# EAGLE design CONVEYOR-v3_0 (EAGLE 9.7.0)

## Sheet 1 of 2
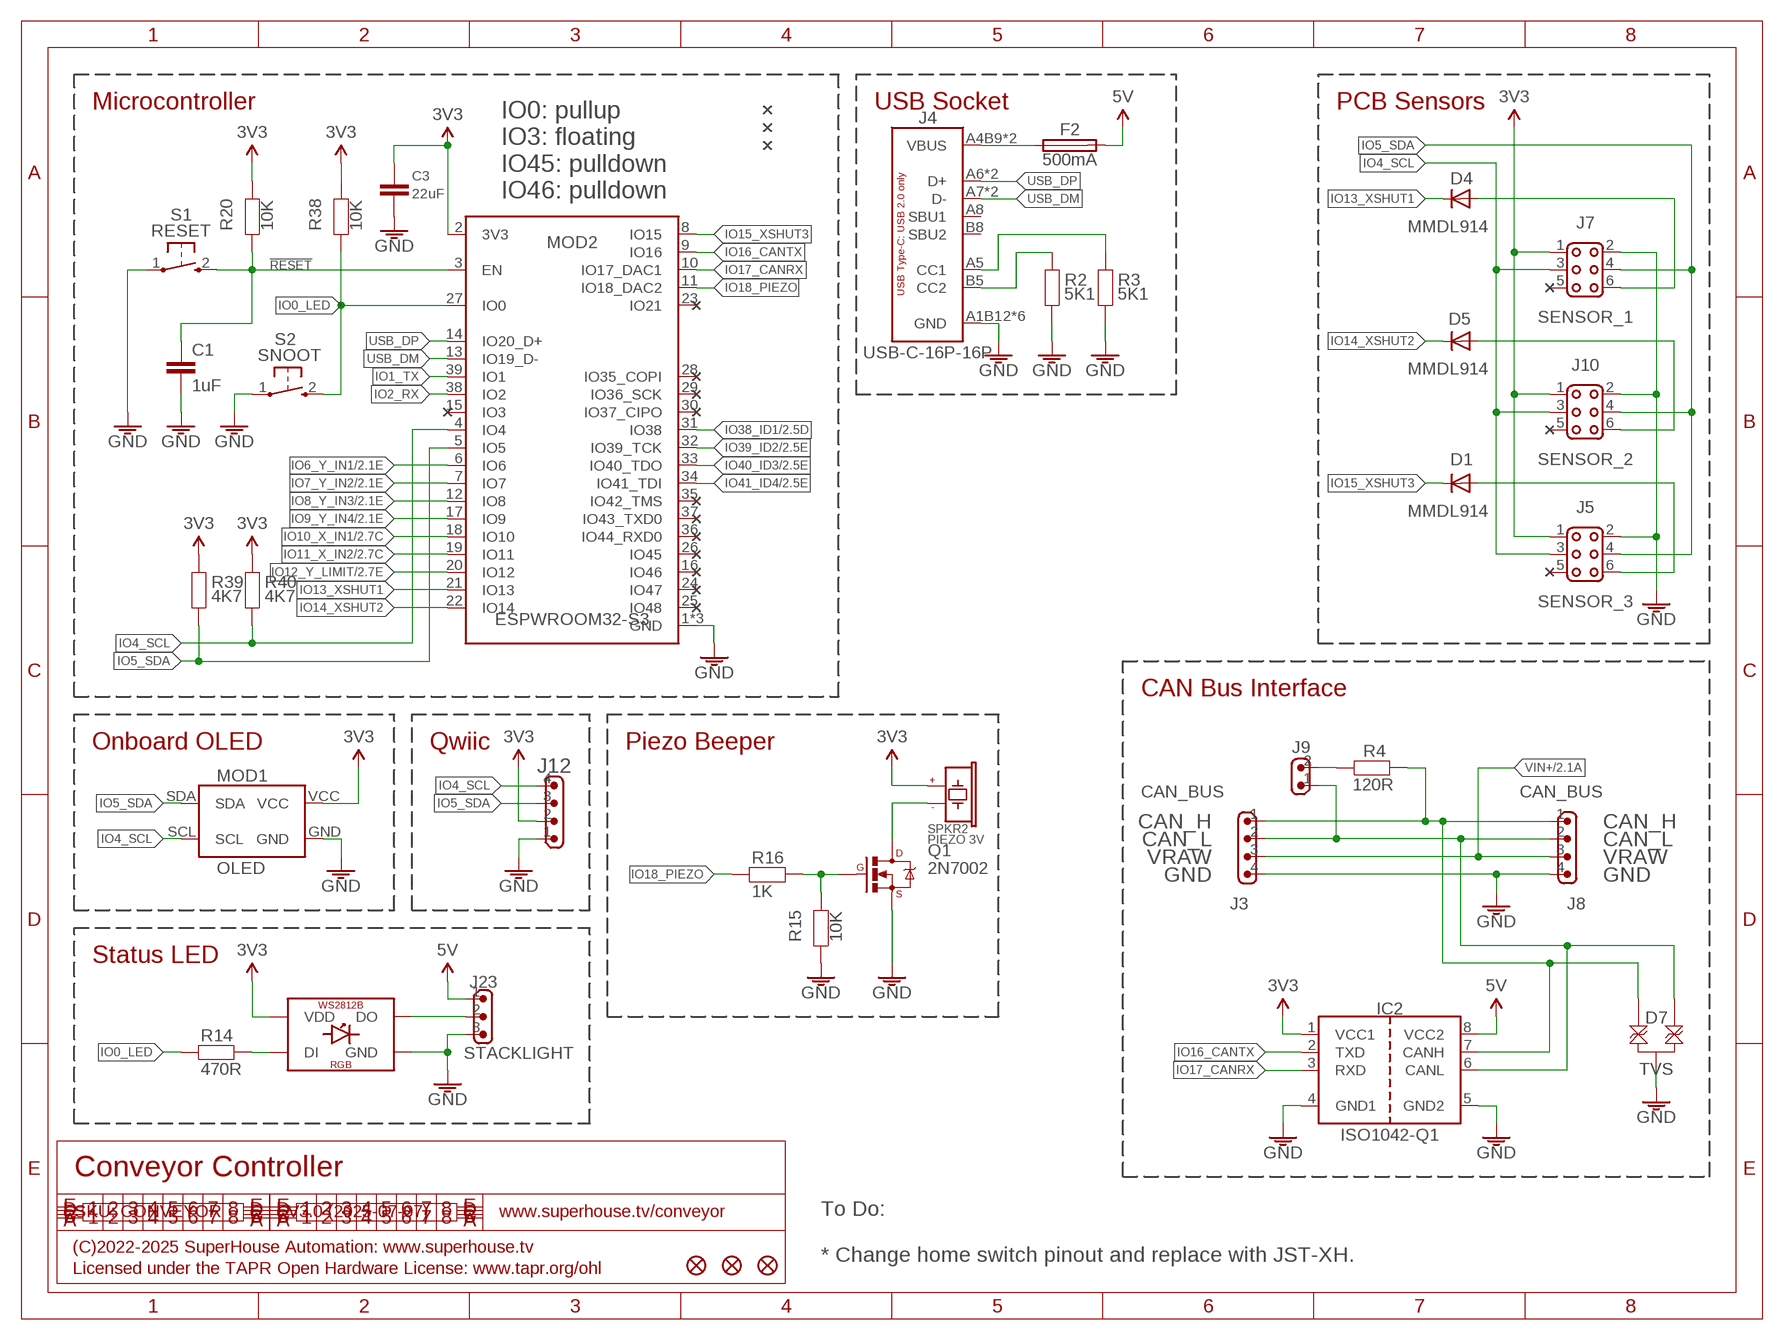
[diagram p0: schematic, sheet 1]

### Parts
C1  1uF  CAP0603  [C0603]
C3  22uF  CAP0805  [C0805]
D1  MMDL914  DIODE-SOD123  [SOD-123]
D4  MMDL914  DIODE-SOD123  [SOD-123]
D5  MMDL914  DIODE-SOD123  [SOD-123]
D7  TVS  TVSDUAL-T24CAN  [SOT23-3]
F2  500mA  PTC-1206  [1206]
IC2  ISO1042-Q1  [SO08-W]
J3  CAN_BUS  M04-SCREW-3.81MM-HOR-PLUG  [SCREWTERMINAL-3.81MM-PLUGGABLE-HOR-4]
J4  USB-C-16P-16P  [USB-C-16P]
J5  SENSOR_3  M02X3-SHROUDED  [2X3-2.54-SHROUDED]
J7  SENSOR_1  M02X3-SHROUDED  [2X3-2.54-SHROUDED]
J8  CAN_BUS  M04-SCREW-3.81MM-HOR-PLUG  [SCREWTERMINAL-3.81MM-PLUGGABLE-HOR-4]
J9  M02-PIN-JUMP-Y  [1X02-P-JUMP-Y]
J10  SENSOR_2  M02X3-SHROUDED  [2X3-2.54-SHROUDED]
J12  M04-SM4B-SH  [JST-SM4B-SH]
J23  STACKLIGHT  M03-PLAIN  [1X03]
LED2  WS2812B-PTH5MM  [5MM4PIN]
MOD1  OLED  OLED-I2C-128X32-0.91-HEADER  [OLED-128X32-0.91-HEADER]
MOD2  ESPWROOM32-S3  ESPWROOM32-S3-WROOM  [ESPWROOM32-S3]
Q1  2N7002  MOSFET-NCHANNEL-233  [SOT23-3]
R2  5K1  RESISTOR0603  [R0603]
R3  5K1  RESISTOR0603  [R0603]
R4  120R  RESISTOR2010  [R2010]
R14  470R  RESISTOR0603  [R0603]
R15  10K  RESISTOR0603  [R0603]
R16  1K  RESISTOR0603  [R0603]
R20  10K  RESISTOR0603  [R0603]
R38  10K  RESISTOR0603  [R0603]
R39  4K7  RESISTOR0603  [R0603]
R40  4K7  RESISTOR0603  [R0603]
S1  RESET  TAC_SWITCH_2PINSMT  [TACTILE_SMT_3X4X2]
S2  SNOOT  TAC_SWITCH_2PINSMT  [TACTILE_SMT_3X4X2]
SPKR2  PIEZO 3V  PIEZOPOLARISED-SMT  [PIEZO-9.6X9.6-SMT]
U$4  FIDUCIAL1X2.5  [FIDUCIAL-1X2.5]
U$5  FIDUCIAL1X2.5  [FIDUCIAL-1X2.5]
U$6  FIDUCIAL1X2.5  [FIDUCIAL-1X2.5]

### Nets
3.3V: C3.1 IC2.1(VCC1) J5.1 J7.1 J10.1 J12.2 LED2.2(VDD) MOD1.VCC MOD2.2(3V3) R20.1 R38.1 R39.1 R40.1 SPKR2.1(+) ; also sheet 2
5V: F2.2 IC2.8(VCC2) J23.1 ; also sheet 2
!RESET: C1.1 MOD2.3(EN) R20.2 S1.2(S)
CAN_H1: D7.2 IC2.7(CANH) J3.1 J8.1 R4.2
CAN_L1: D7.1 IC2.6(CANL) J3.2 J8.2 J9.1
GND: C1.2 C3.2 D7.3 IC2.4(GND1) IC2.5(GND2) J3.4 J4.A1B12(GND) J4.A12B1(GND) J4.FIX1(GND) J4.FIX2(GND) J4.FIX3(GND) J4.FIX4(GND) J5.2 J7.2 J8.4 J10.2 J12.1 J23.3 LED2.3(GND) MOD1.GND MOD2.1(GND) MOD2.40(GND) MOD2.41(GND) Q1.2(S) R2.2 R3.2 R15.2 S1.1(P) S2.1(P) ; also sheet 2
IO0_LED: MOD2.27(IO0) R14.1 R38.2 S2.2(S)
IO1_TX: MOD2.39(IO1)
IO2_RX: MOD2.38(IO2)
IO4_SCL: J5.3 J7.3 J10.3 J12.4 MOD1.SCL MOD2.4(IO4) R40.2
IO5_SDA: J5.4 J7.4 J10.4 J12.3 MOD1.SDA MOD2.5(IO5) R39.2
IO6_Y_IN1: MOD2.6(IO6) ; also sheet 2
IO7_Y_IN2: MOD2.7(IO7) ; also sheet 2
IO8_Y_IN3: MOD2.12(IO8) ; also sheet 2
IO9_Y_IN4: MOD2.17(IO9) ; also sheet 2
IO10_X_IN1: MOD2.18(IO10) ; also sheet 2
IO11_X_IN2: MOD2.19(IO11) ; also sheet 2
IO12_Y_LIMIT: MOD2.20(IO12) ; also sheet 2
IO13_XSHUT1: D4.1(C) MOD2.21(IO13)
IO14_XSHUT2: D5.1(C) MOD2.22(IO14)
IO15_XSHUT3: D1.1(C) MOD2.8(IO15)
IO16_CANTX: IC2.2(TXD) MOD2.9(IO16)
IO17_CANRX: IC2.3(RXD) MOD2.10(IO17_DAC1)
IO18_PIEZO: MOD2.11(IO18_DAC2) R16.1
IO38_ID1: MOD2.31(IO38) ; also sheet 2
IO39_ID2: MOD2.32(IO39_TCK) ; also sheet 2
IO40_ID3: MOD2.33(IO40_TDO) ; also sheet 2
IO41_ID4: MOD2.34(IO41_TDI) ; also sheet 2
N$1: J9.2 R4.1
N$2: LED2.4(DI) R14.2
N$3: D1.2(A) J5.6
N$6: J4.B5(CC2) R2.1
N$7: J4.A5(CC1) R3.1
N$11: F2.1 J4.A4B9(VBUS) J4.A9B4(VBUS)
N$21: J23.2 LED2.1(DO)
N$22: D5.2(A) J10.6
N$23: Q1.1(G) R15.1 R16.2
N$24: Q1.3(D) SPKR2.2(-)
N$27: D4.2(A) J7.6
USB_DM: J4.A7(D-) J4.B7(D-) MOD2.13(IO19_D-)
USB_DP: J4.A6(D+) J4.B6(D+) MOD2.14(IO20_D+)
VIN+: J3.3 J8.3 ; also sheet 2
Unconnected: J4.A8(SBU1) J4.B8(SBU2) J5.5 J7.5 J10.5 MOD2.15(IO3) MOD2.23(IO21) MOD2.24(IO47) MOD2.25(IO48) MOD2.26(IO45) MOD2.28(IO35_COPI) MOD2.29(IO36_SCK) MOD2.30(IO37_CIPO) MOD2.35(IO42_TMS) MOD2.36(IO44_RXD0) MOD2.37(IO43_TXD0)

### Notes on the sheet
- Microcontroller | USB Socket | PCB Sensors
- IO0: pullup
  IO3: floating
  IO45: pulldown
  IO46: pulldown
- CAN Bus Interface
- Onboard OLED | Qwiic | Piezo Beeper
- CAN_H | CAN_H
- CAN_L | CAN_L
- VRAW | VRAW
- GND | GND
- Status LED
- Conveyor Controller
- SKU: CONVEYOR | V3.0 (2025-07-07) | www.superhouse.tv/conveyor
- (C)2022-2025 SuperHouse Automation: www.superhouse.tv
- To Do:
  
  * Change home switch pinout and replace with JST-XH.
- Licensed under the TAPR Open Hardware License: www.tapr.org/ohl

## Sheet 2 of 2
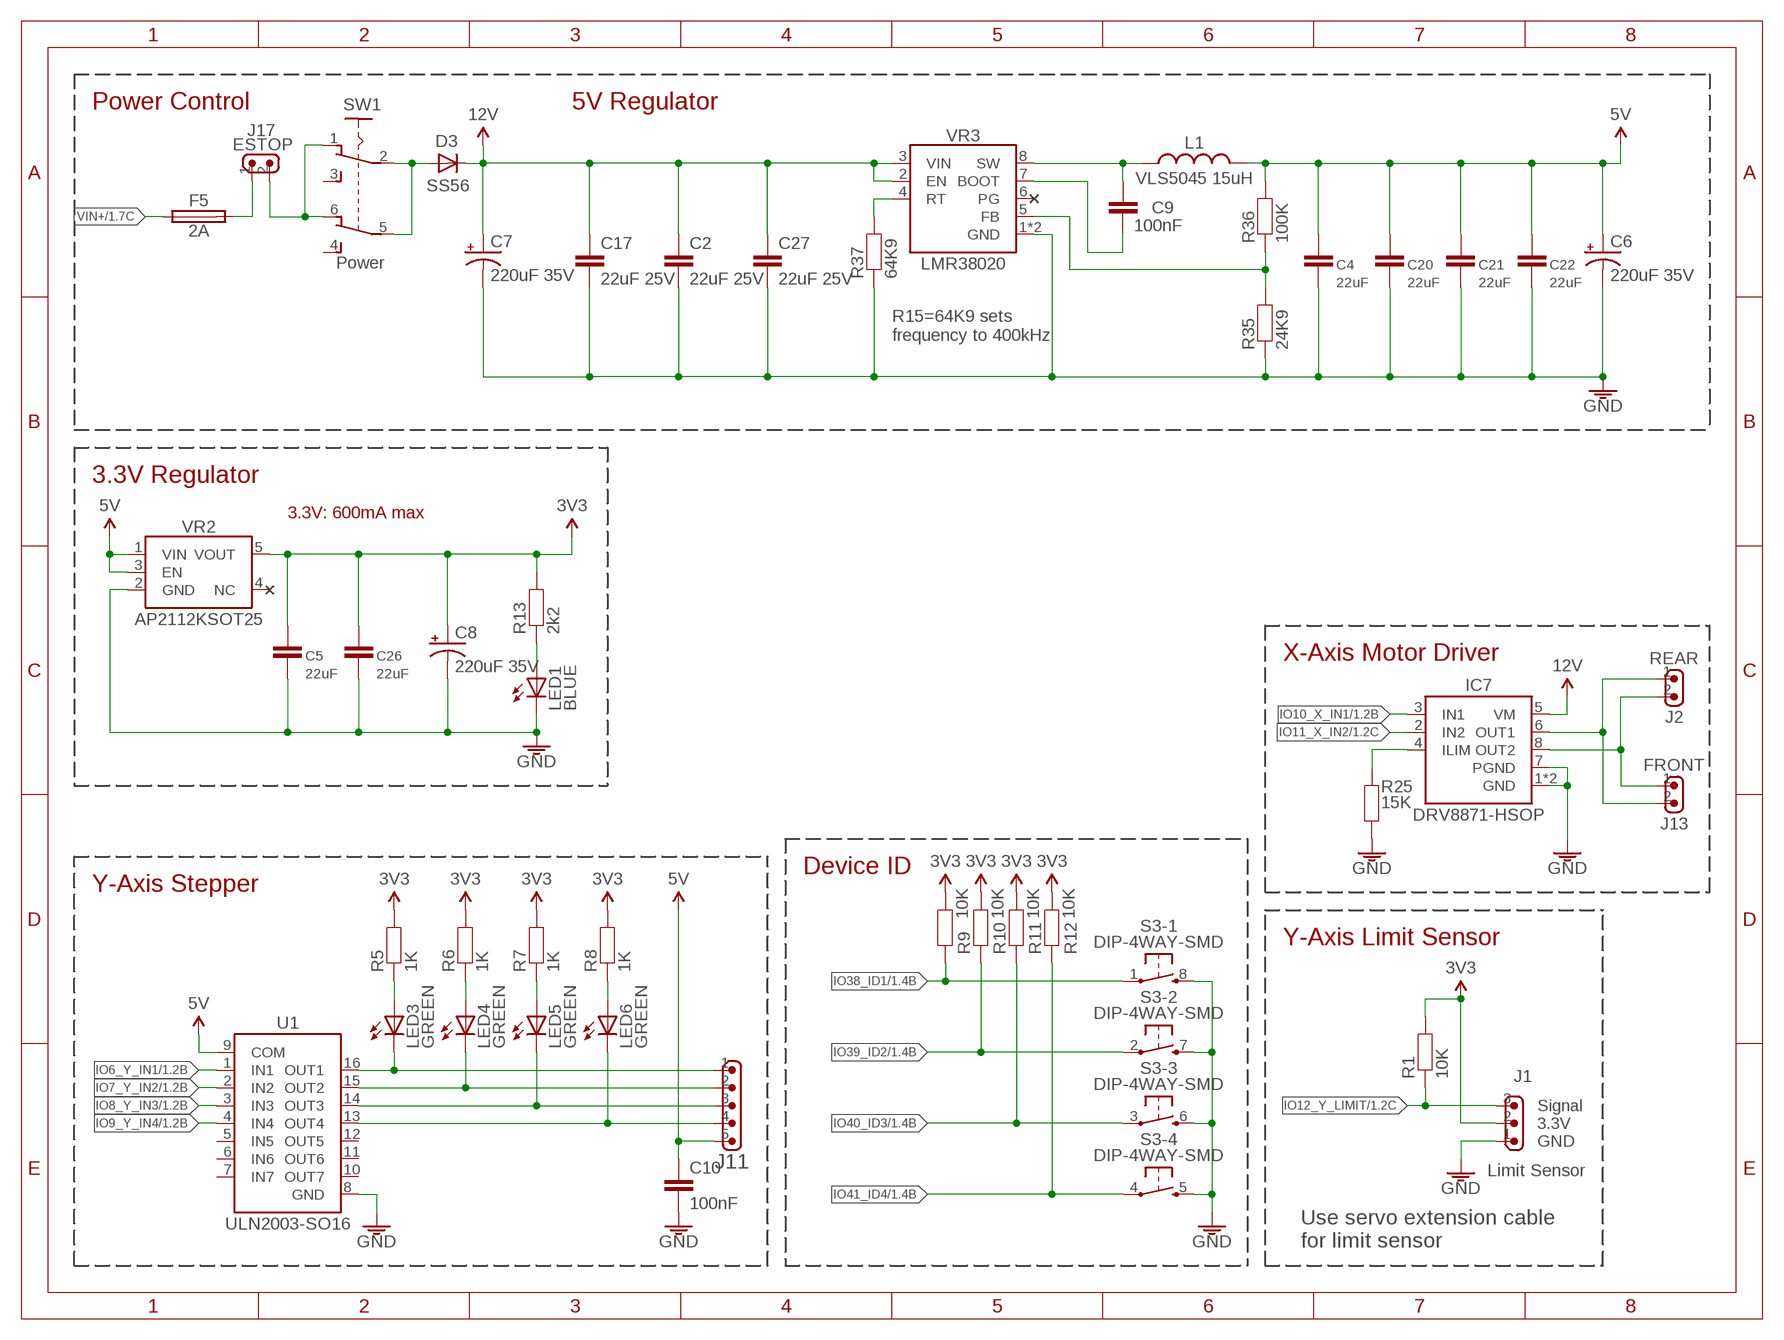
[diagram p1: schematic, sheet 2]

### Parts
C2  22uF 25V  CAP0805  [C0805]
C4  22uF  CAP0805  [C0805]
C5  22uF  CAP0805  [C0805]
C6  220uF 35V  CAP_POLG  [PANASONIC_G]
C7  220uF 35V  CAP_POLG  [PANASONIC_G]
C8  220uF 35V  CAP_POLG  [PANASONIC_G]
C9  100nF  CAP0603  [C0603]
C10  100nF  CAP0603  [C0603]
C17  22uF 25V  CAP0805  [C0805]
C20  22uF  CAP0805  [C0805]
C21  22uF  CAP0805  [C0805]
C22  22uF  CAP0805  [C0805]
C26  22uF  CAP0805  [C0805]
C27  22uF 25V  CAP0805  [C0805]
D3  SS56  DIODESMA  [SMA-DIODE]
F5  2A  FUSE-OMNIBLOK  [OMNIBLOK]
IC7  DRV8871-HSOP  [SOIC8T]
J1  Limit Sensor  M03-PIN  [1X03-P]
J2  REAR  M02-B2B-XH  [JST-B2B-XH-A]
J11  M05-B5B-XH  [JST-B5B-XH-A]
J13  FRONT  M02-B2B-XH  [JST-B2B-XH-A]
J17  ESTOP  M02-SCREW-3.81MM-HOR  [SCREWTERMINAL-3.81MM-PLUGGABLE-HOR-2]
L1  VLS5045 15uH  INDUCTOR-5045  [INDUCTOR-5045]
LED1  BLUE  LED0603  [LED-0603]
LED3  GREEN  LED0603  [LED-0603]
LED4  GREEN  LED0603  [LED-0603]
LED5  GREEN  LED0603  [LED-0603]
LED6  GREEN  LED0603  [LED-0603]
R1  10K  RESISTOR0603  [R0603]
R5  1K  RESISTOR0603  [R0603]
R6  1K  RESISTOR0603  [R0603]
R7  1K  RESISTOR0603  [R0603]
R8  1K  RESISTOR0603  [R0603]
R9  10K  RESISTOR0603  [R0603]
R10  10K  RESISTOR0603  [R0603]
R11  10K  RESISTOR0603  [R0603]
R12  10K  RESISTOR0603  [R0603]
R13  2k2  RESISTOR0603  [R0603]
R25  15K  RESISTOR0603  [R0603]
R35  24K9  RESISTOR0603  [R0603]
R36  100K  RESISTOR0603  [R0603]
R37  64K9  RESISTOR0603  [R0603]
S3  DIP-4WAY-SMD  [DIP-8-SMD]
SW1  Power  SWITCH-DPDT3  [7201SD9AV2BE]
U1  ULN2003-SO16  [SO16]
VR2  AP2112KSOT25  [SOT23-5]
VR3  LMR38020  LMR38010  [HSOIC8]

### Nets
3.3V: C5.1 C8.+ C26.1 J1.2 R1.2 R5.2 R6.2 R7.2 R8.2 R9.2 R10.2 R11.2 R12.2 R13.2 VR2.5(VOUT) ; also sheet 1
5V: C4.1 C6.+ C10.1 C20.1 C21.1 C22.1 J11.5 L1.2 R36.2 U1.9(COM) VR2.1(VIN) VR2.3(EN) ; also sheet 1
12V: C2.1 C7.+ C17.1 C27.1 D3.C IC7.5(VM) VR3.2(EN) VR3.3(VIN)
GND: C2.2 C4.2 C5.2 C6.- C7.- C8.- C10.2 C17.2 C20.2 C21.2 C22.2 C26.2 C27.2 IC7.1(GND) IC7.7(PGND) IC7.TGND(GND) J1.1 LED1.C R25.1 R35.1 R37.1 S3.5(-4:S) S3.6(-3:S) S3.7(-2:S) S3.8(-1:S) U1.8(GND) VR2.2(GND) VR3.1(GND) VR3.TGND(GND) ; also sheet 1
IO6_Y_IN1: U1.1(IN1) ; also sheet 1
IO7_Y_IN2: U1.2(IN2) ; also sheet 1
IO8_Y_IN3: U1.3(IN3) ; also sheet 1
IO9_Y_IN4: U1.4(IN4) ; also sheet 1
IO10_X_IN1: IC7.3(IN1) ; also sheet 1
IO11_X_IN2: IC7.2(IN2) ; also sheet 1
IO12_Y_LIMIT: J1.3 R1.1 ; also sheet 1
IO38_ID1: R9.1 S3.1(-1:P) ; also sheet 1
IO39_ID2: R10.1 S3.2(-2:P) ; also sheet 1
IO40_ID3: R11.1 S3.3(-3:P) ; also sheet 1
IO41_ID4: R12.1 S3.4(-4:P) ; also sheet 1
N$4: J17.2 SW1.1 SW1.6
N$5: IC7.4(ILIM) R25.2
N$8: F5.2 J17.1
N$9: D3.A SW1.2 SW1.5
N$12: LED3.A R5.1
N$13: J11.1 LED3.C U1.16(OUT1)
N$14: LED4.A R6.1
N$15: LED5.A R7.1
N$16: LED6.A R8.1
N$17: J11.2 LED4.C U1.15(OUT2)
N$18: J11.3 LED5.C U1.14(OUT3)
N$19: J11.4 LED6.C U1.13(OUT4)
N$25: IC7.6(OUT1) J2.1 J13.2
N$26: IC7.8(OUT2) J2.2 J13.1
N$29: LED1.A R13.1
N$30: C9.1 L1.1 VR3.8(SW)
N$33: R37.2 VR3.4(RT)
N$35: R35.2 R36.1 VR3.5(FB)
N$37: C9.2 VR3.7(BOOT)
VIN+: F5.1 ; also sheet 1
Unconnected: SW1.3 SW1.4 U1.5(IN5) U1.6(IN6) U1.7(IN7) U1.10(OUT7) U1.11(OUT6) U1.12(OUT5) VR2.4(NC)

### Notes on the sheet
- Power Control | 5V Regulator
- R15=64K9 sets
  frequency to 400kHz
- 3.3V Regulator
- 3.3V: 600mA max
- X-Axis Motor Driver
- Device ID
- Y-Axis Stepper
- Y-Axis Limit Sensor
- Signal
- 3.3V
- GND
- Use servo extension cable
  for limit sensor

## Power pins joined to a net without a drawn wire
IO46: MOD2.16(IO46)
PG: VR3.6(PG)

## Library data of the parts
C1-C5 C9 C10 C17 C20-C22 C26 C27 = SuperHouse-Capacitors:CAP: Capacitor Standard ceramic capacitor
C6-C8 = SuperHouse-Capacitors:CAP_POL: Capacitor Polarized These are standard SMD and PTH capacitors. Normally 10uF, 47uF, and 100uF in electrolytic and tantalum varieties. Always verify the external diameter of the through hole cap, it varies with capacity, voltage, and manufacturer. The EIA devices should be standard.
D1 D3-D5 = SuperHouse-Diodes:DIODE: Diode Standard reverse protection diodes and small signal diodes. SMA package can handle up to about 1A. SOD-323 can handle about 200mA.
D7 = SuperHouse-Diodes:TVSDUAL: Transient Voltage Suppressor (dual)
F2 = SuperHouse-Fuses:PTC: Resettable polyfuses
F5 = SuperHouse-Fuses:FUSE: Fuse
IC2 = SuperHouse-ICs:ISO1042-Q1
IC7 = SuperHouse-MotorDrivers:DRV8871: TI DRV8871 3.6A brushed DC motor driver
J1 J23 = SuperHouse-Connectors:M03: 3-way header Standard 1x3 header, and screw terminal variations
J2 J9 J13 J17 = SuperHouse-Connectors:M02: 2-way header Standard 1x2 header, and screw terminal variations
J3 J8 J12 = SuperHouse-Connectors:M04: 4-way header Standard 1x4 header, and screw terminal variations
J4 = SuperHouse-Connectors:USB-C-16P: USB-C socket with 16 pins, suitable only for backward compatibility with USB 2
J5 J7 J10 = SuperHouse-Connectors:M02X3: M6 header in 2x3 format
J11 = SuperHouse-Connectors:M05: 5-way header Standard 1x5 header, and screw terminal variations
L1 = SuperHouse-Inductors:INDUCTOR: INDUCTOR, American symbol
LED1 LED3-LED6 = SuperHouse-LEDs:LED: LEDs in various sizes including 5mm and 3mm PTH, and 0402, 0603, 0805, etc SMT
LED2 = SuperHouse-LEDs:WS2812B: WS2812B addressable RGB LED
MOD1 = SuperHouse-Displays:OLED-I2C: OLED module with SSD1306 I2C driver
MOD2 = SuperHouse-MCUs:ESPWROOM32-S3
Q1 = SuperHouse-Transistors:MOSFET-NCHANNEL: N-channel MOSFET
R1-R16 R20 R25 R35-R40 = SuperHouse-Resistors:RESISTOR: Resistors in both surface-mount and through-hole versions.
S1 S2 = SuperHouse-Switches:TAC_SWITCH_2PIN: Momentary Tactile Switch - 2 pin Uxcell 3x4x2mm switch with 2 SMT pads
S3 = SuperHouse-Switches:DIP-4WAY
SPKR2 = SuperHouse-Audio:PIEZOPOLARISED
SW1 = SuperHouse-Switches:SWITCH-DPDT: DPDT toggle switch
U1 = SuperHouse-ICs:ULN2003: 7-channel Darlington array, commonly used as a low-power stepper motor driver
U$4-U$6 = SuperHouse-Symbols:FIDUCIAL: Fiducial Alignment Points Various fiducial points for machine vision alignment.
VR2 = SuperHouse-Regulators:AP2112K: AP2112K LDO linear voltage regulator
VR3 = SuperHouse-Regulators:LMR38010

## Net classes
0 Default: width 0.203 mm
1 VCC: width 0.305 mm

## Board
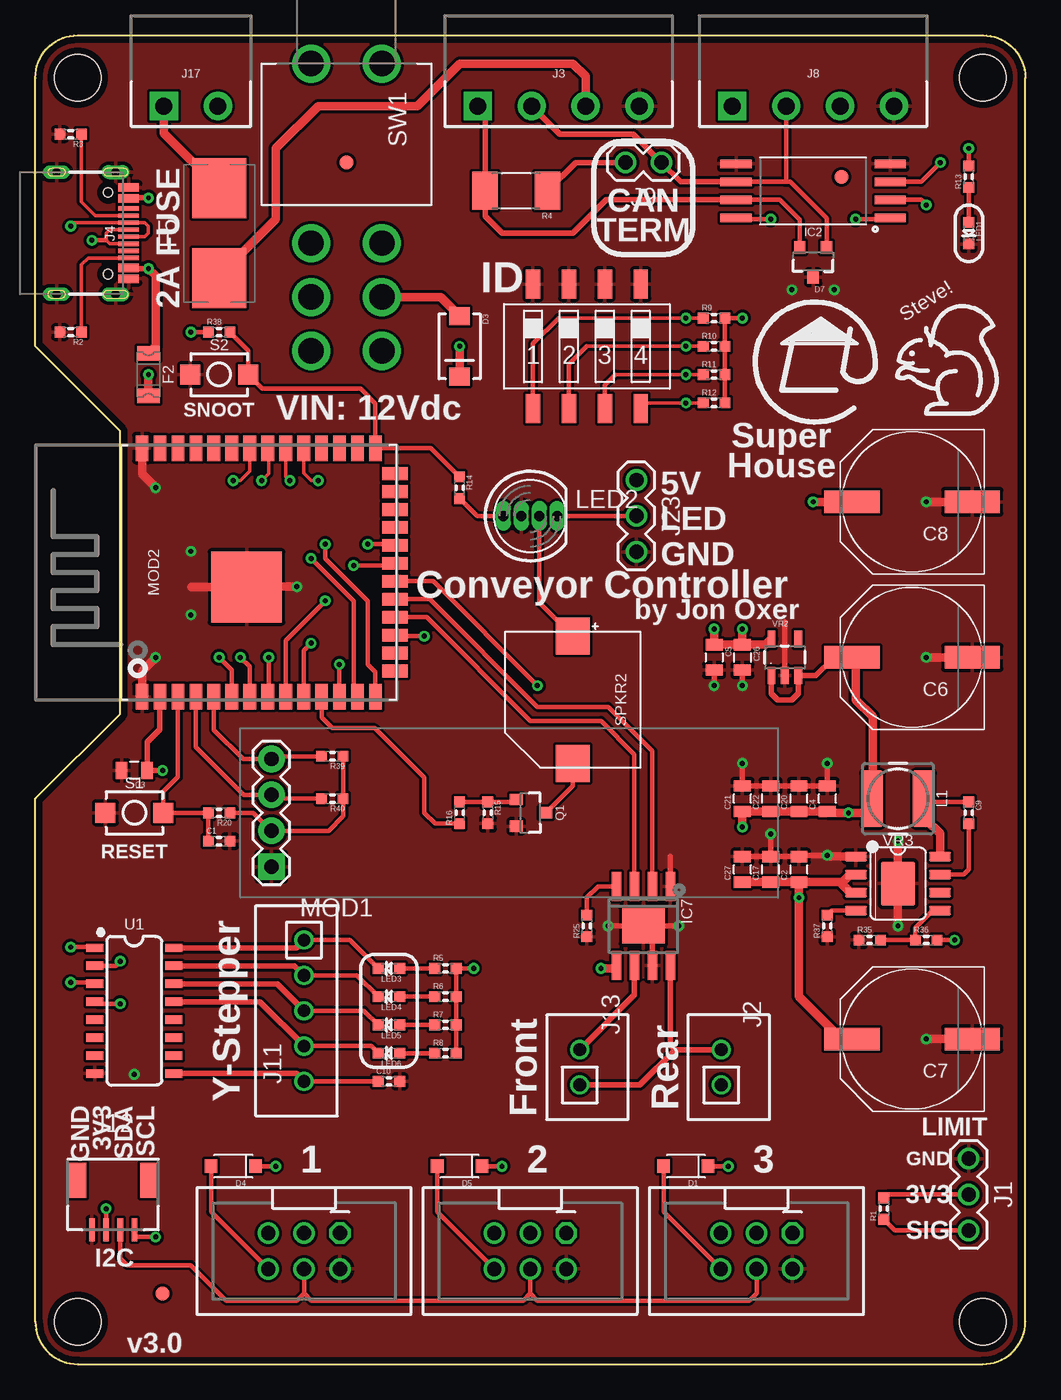
[diagram p2: board, top side]
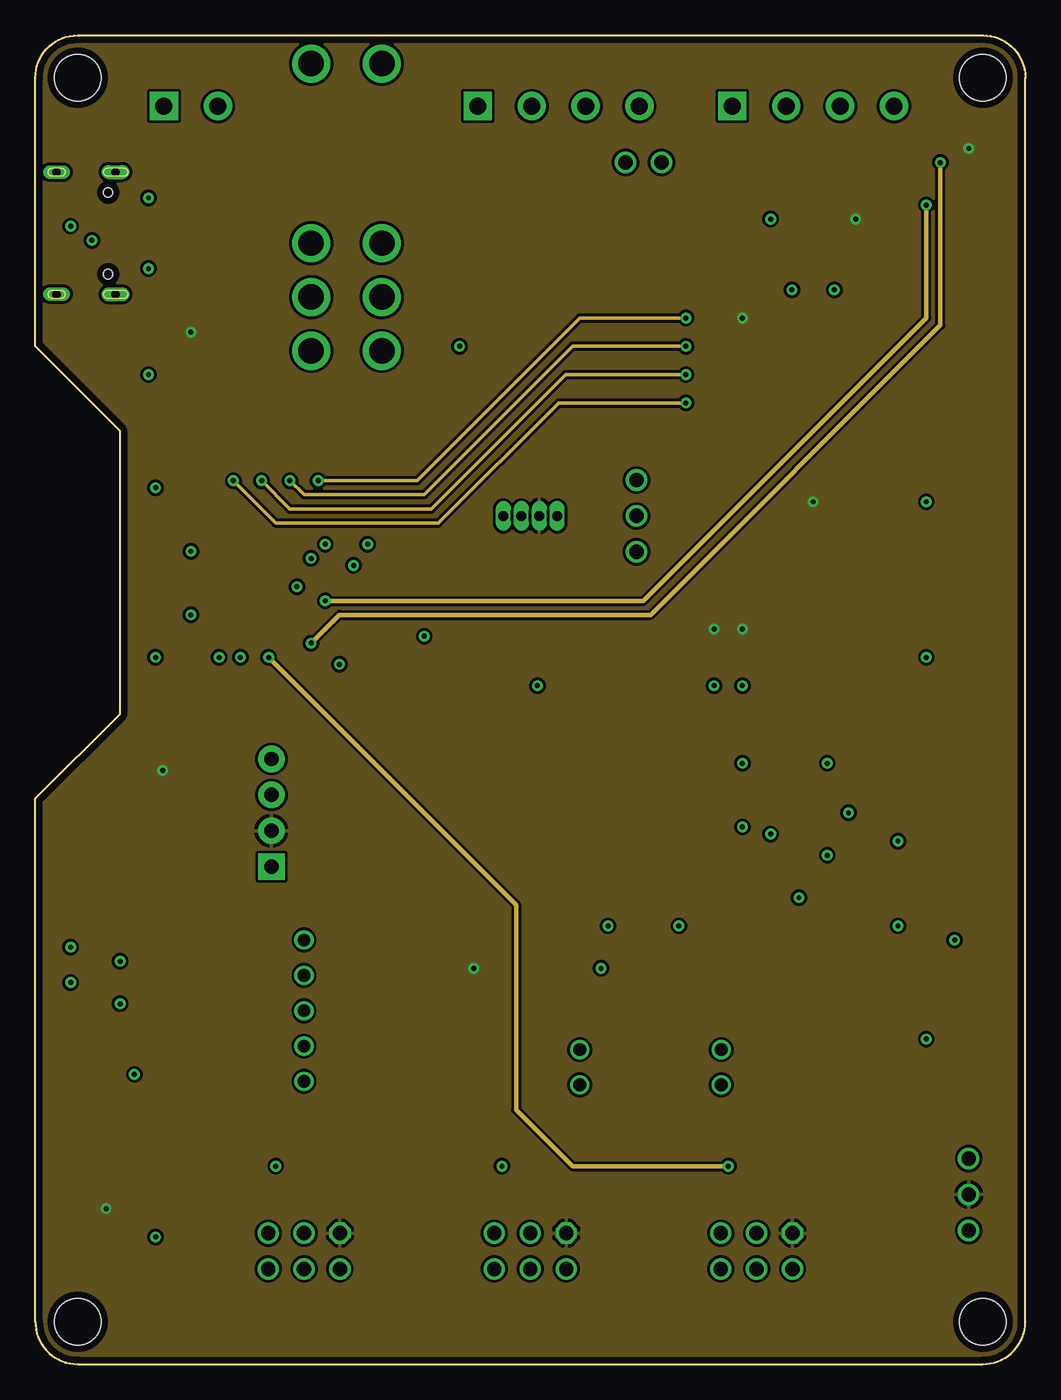
[diagram p3: board, inner layer Route2]
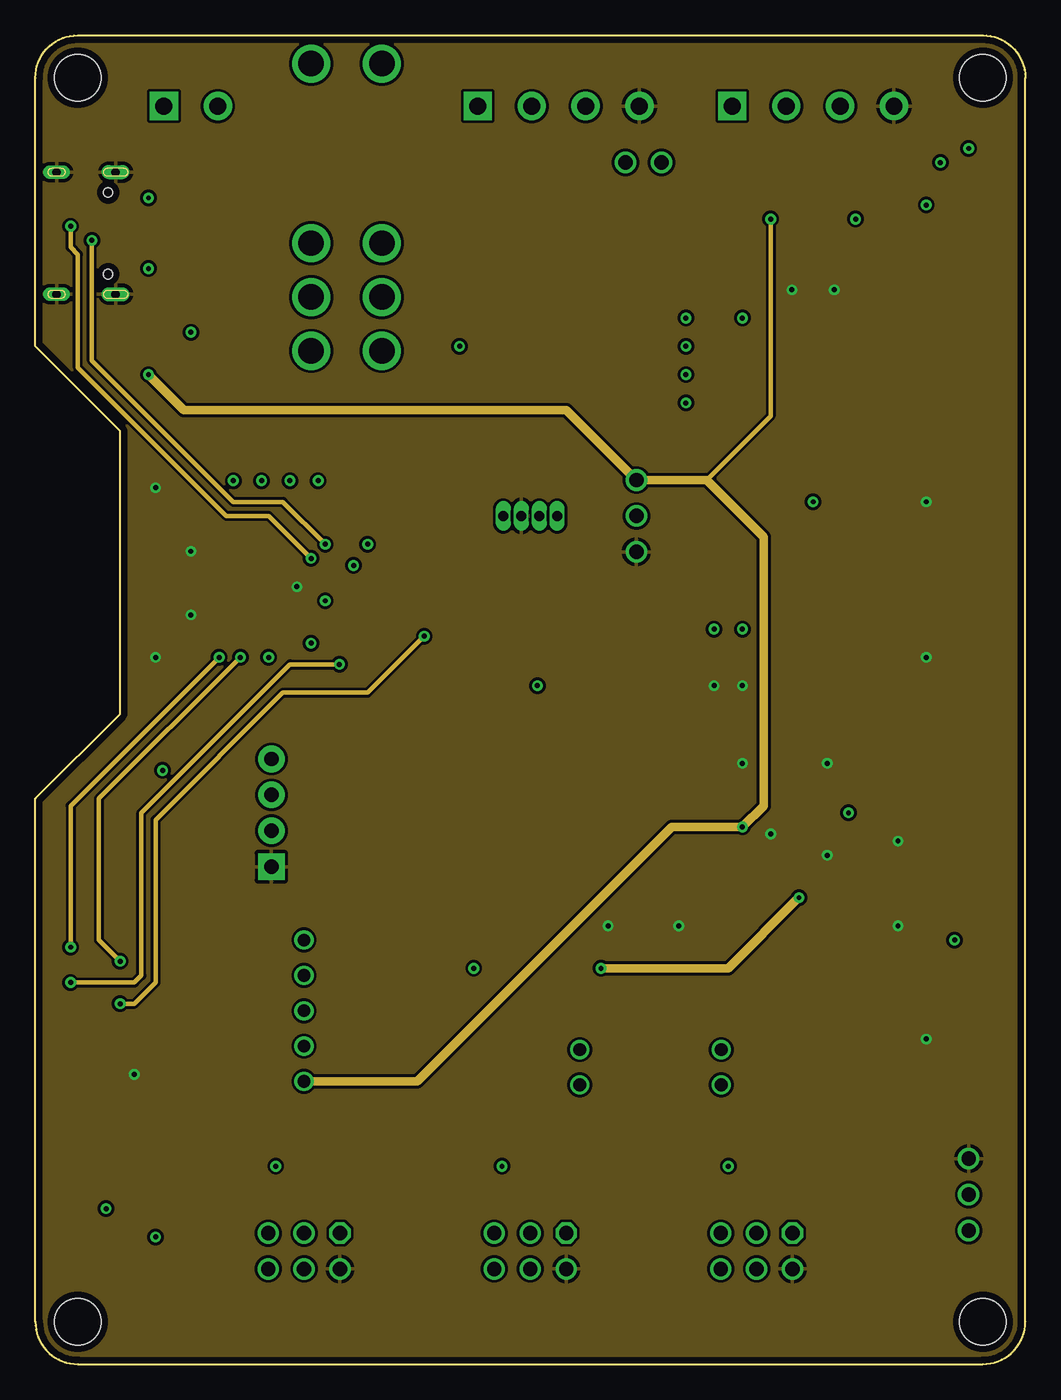
[diagram p4: board, inner layer Route15]
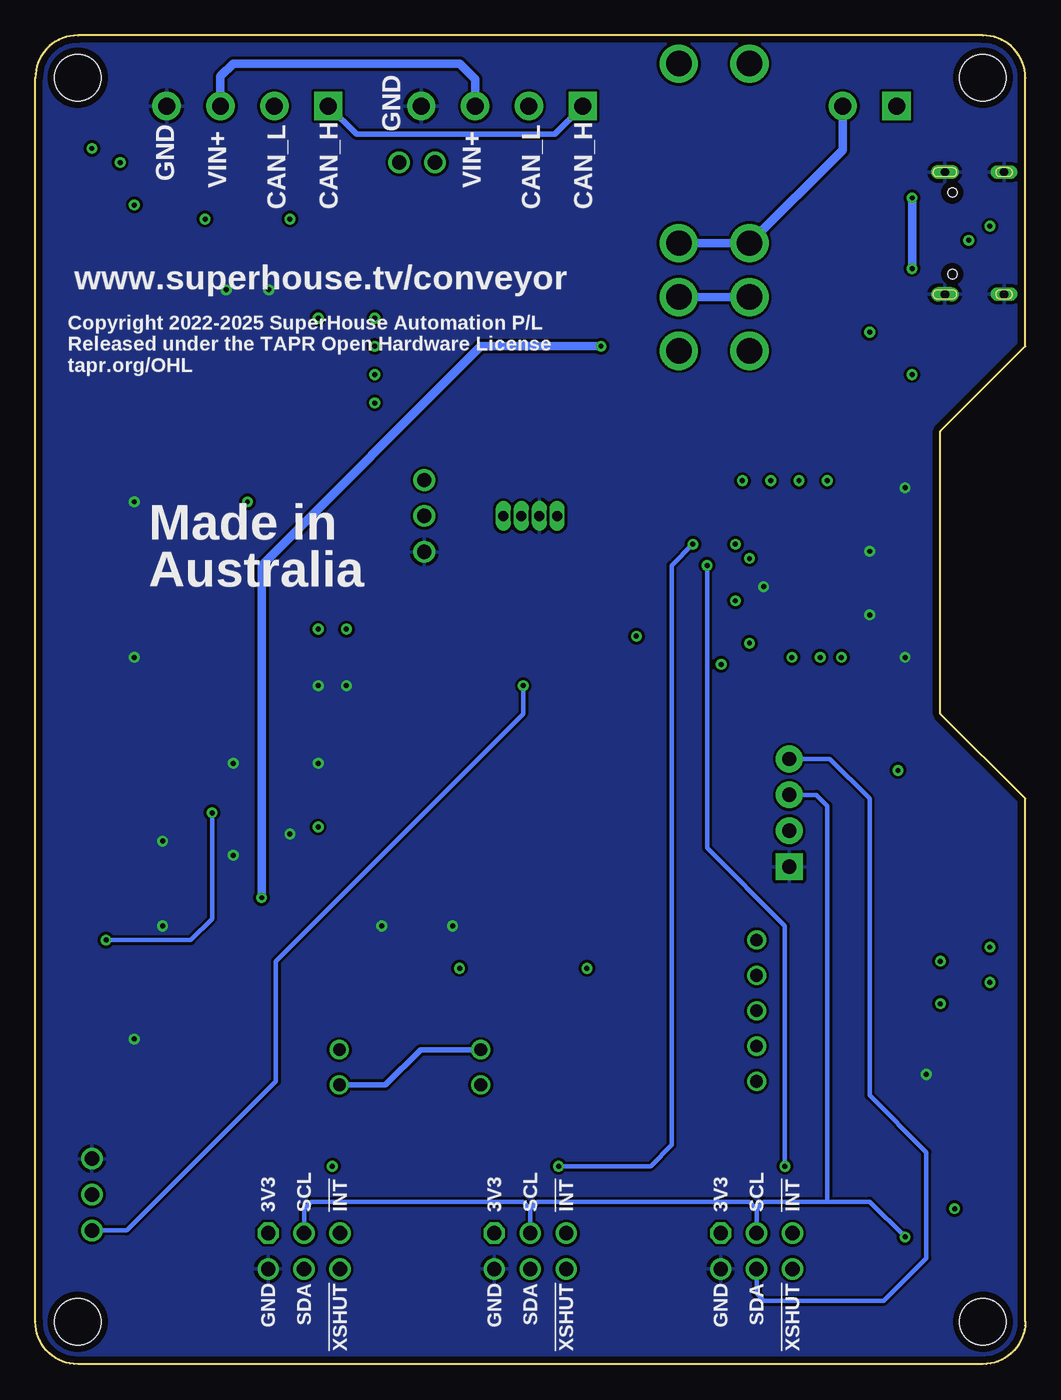
[diagram p5: board, bottom side, seen from below]

Size 70 x 94 mm. Coordinates in mm from the lower left corner, seen from the top.
Outline: 0,3 0,40 6,46 6,66 0,72 0,91 arc-90 3,94 67,94 arc-90 70,91 70,3 arc-90 67,0 3,0 arc-90 0,3
Copper layers (1+2*15+16): Top 0.035mm / dielectric 1.5mm / Route2 0.035mm / dielectric 0.15mm / Route15 0.035mm / dielectric 0.2mm / Bottom 0.035mm
Design rules "SuperHouse-Design-Rules *": minimum track width 10mil, minimum drill 24mil, track to track 8mil, track to pad 8mil, pad to pad 8mil, via to via 8mil, smd to smd 6mil, copper to edge 18mil, drill to drill 8mil, minimum pad ring 7mil, minimum via ring 8mil, stop-mask expansion 4mil, vias tented up to drill 0.5mm, thermal gap 10mil
Holes 3.3 mm at 67,91 3,91 67,3 3,3

### Footprints (pad centres in the part's own frame; a part is rotated, then mirrored left to right if it is on the bottom)
C0603 = smd 0.762 x 0.762: 1 -0.762,0; 2 0.762,0
C0805 = smd 0.8 x 1.2: 1 -0.9,0; 2 0.9,0
PANASONIC_G = smd 3.9 x 1.6: + 4.25,0; - -4.25,0
SOD-123 = smd 0.9 x 0.95: 1 -1.575,0; 2 1.575,0
SMA-DIODE = smd 1.27 x 1.47: A -2.15,0; C 2.15,0
SOT23-3 = smd 0.8 x 0.9: 1 -0.95,-1; 2 0.95,-1; 3 0,1.1
1206 = smd 1 x 1.6: 1 -1.5,0; 2 1.5,0
OMNIBLOK = smd 4.24 x 3.81: 1 -3.185,0; 2 3.185,0
SO08-W = smd 2.21 x 0.61: 1 -5.45,1.905; 2 -5.45,0.635; 3 -5.45,-0.635; 4 -5.45,-1.905; 5 5.45,-1.905; 6 5.45,-0.635; 7 5.45,0.635; 8 5.45,1.905
SOIC8T = smd 2.032 x 0.66: 1 -2.794,1.905; 2 -2.794,0.635; 3 -2.794,-0.635; 4 -2.794,-1.905; 5 2.794,-1.905; 6 2.794,-0.635; 7 2.794,0.635; 8 2.794,1.905 | smd 2.489 x 2.997: TGND 0,0
1X03-P = drill 1.016: 1 -2.54,0; 2 0,0; 3 2.54,0
JST-B2B-XH-A = drill 0.9: 1 1.25,0; 2 -1.25,0
SCREWTERMINAL-3.81MM-PLUGGABLE-HOR-4 = drill 1.2 pad 2 square: 1 -5.715,0 | drill 1.2 pad 2: 2 -1.902,0; 3 1.908,0; 4 5.718,0
USB-C-16P = smd 0.6 x 1.45: A1B12 -3.225,5.095; A4B9 -2.45,5.095; A9B4 2.45,5.095; A12B1 3.225,5.095 | smd 0.3 x 1.45: A5 -1.25,5.095; A6 -0.25,5.095; A7 0.25,5.095; A8 1.25,5.095; B5 1.75,5.095; B6 0.75,5.095; B7 -0.75,5.095; B8 -1.75,5.095 | drill 0.6 pad 0.8 long: FIX1 -4.32,0; FIX4 4.32,0 | drill 0.6 pad 1 long: FIX2 -4.32,4.18; FIX3 4.32,4.18 | hole 0.65: 2.89,3.65; -2.89,3.65
2X3-2.54-SHROUDED = drill 1 octagon: 1 -2.54,-1.27 | drill 1: 2 -2.54,1.27; 3 0,-1.27; 4 0,1.27; 5 2.54,-1.27; 6 2.54,1.27
1X02-P-JUMP-Y = drill 1.016: 1 -1.27,0; 2 1.27,0
JST-B5B-XH-A = drill 0.9: 1 5,0; 2 2.5,0; 3 0,0; 4 -2.5,0; 5 -5,0
JST-SM4B-SH = smd 0.4 x 1.6: 1 -1.5,0; 2 -0.5,0; 3 0.5,0; 4 1.5,0 | smd 1.2 x 2.5: GND@1 -2.5,3.5; GND@2 2.5,3.5
SCREWTERMINAL-3.81MM-PLUGGABLE-HOR-2 = drill 1.2 pad 2 square: 1 -1.905,0 | drill 1.2 pad 2: 2 1.908,0
1X03 = drill 1.016: 1 -2.54,0; 2 0,0; 3 2.54,0
INDUCTOR-5045 = smd 4 x 1.5: 1 0,1.8; 2 0,-1.8
LED-0603 = smd 0.762 x 0.762: A -0.762,0; C 0.762,0
5MM4PIN = drill 0.7 pad 1.016 long: 1 1.905,0; 2 0.635,0; 3 -0.635,0; 4 -1.905,0
OLED-128X32-0.91-HEADER = drill 1.016 pad 1.88 square: GND -18.31,-3.81 | drill 1.016 pad 1.88: SCL -18.31,1.27; SDA -18.31,3.81; VCC -18.31,-1.27
ESPWROOM32-S3 = smd 1.8 x 0.9: 1 -8.8,-1.5; 2 -8.8,-2.77; 3 -8.8,-4.04; 4 -8.8,-5.31; 5 -8.8,-6.58; 6 -8.8,-7.85; 7 -8.8,-9.12; 8 -8.8,-10.39; 9 -8.8,-11.66; 10 -8.8,-12.93; 11 -8.8,-14.2; 12 -8.8,-15.47; 13 -8.8,-16.74; 14 -8.8,-18.01; 27 8.8,-18.01; 28 8.8,-16.74; 29 8.8,-15.47; 30 8.8,-14.2; 31 8.8,-12.93; 32 8.8,-11.66; 33 8.8,-10.39; 34 8.8,-9.12; 35 8.8,-7.85; 36 8.8,-6.58; 37 8.8,-5.31; 38 8.8,-4.04; 39 8.8,-2.77; 40 8.8,-1.5 | smd 0.9 x 1.8: 15 -6.97,-19.4; 16 -5.7,-19.4; 17 -4.43,-19.4; 18 -3.16,-19.4; 19 -1.89,-19.4; 20 -0.62,-19.4; 21 0.65,-19.4; 22 1.92,-19.4; 23 3.19,-19.4; 24 4.46,-19.4; 25 5.73,-19.4; 26 7,-19.4 | smd 5 x 5: 41 -1.03,-8.89
R0603 = smd 0.762 x 0.762: 1 -0.762,0; 2 0.762,0
R2010 = smd 1.8 x 2.7: 1 -2.2,0; 2 2.2,0
TACTILE_SMT_3X4X2 = smd 1.4 x 1.4: 1 -2.05,0; 2 2.05,0
DIP-8-SMD = smd 1.016 x 2.032: 1 -3.81,-4.4; 2 -1.27,-4.4; 3 1.27,-4.4; 4 3.81,-4.4; 5 3.81,4.4; 6 1.27,4.4; 7 -1.27,4.4; 8 -3.81,4.4
PIEZO-9.6X9.6-SMT = smd 2.6 x 2.4: 1 -4.5,0; 2 4.5,0
7201SD9AV2BE = drill 1.8: 1 12.7,-2.5; 2 16.51,-2.5; 3 20.32,-2.5; 4 20.32,2.5; 5 16.51,2.5; 6 12.7,2.5; 7 0,2.5; 8 0,-2.5
SO16 = smd 1.2 x 0.6: 1 -2.8,4.445; 2 -2.8,3.175; 3 -2.8,1.905; 4 -2.8,0.635; 5 -2.8,-0.635; 6 -2.8,-1.905; 7 -2.8,-3.175; 8 -2.8,-4.445; 9 2.8,-4.445; 10 2.8,-3.175; 11 2.8,-1.905; 12 2.8,-0.635; 13 2.8,0.635; 14 2.8,1.905; 15 2.8,3.175; 16 2.8,4.445
FIDUCIAL-1X2.5 = smd 1 x 1: 1 0,0
SOT23-5 = smd 0.55 x 1.2: 1 -0.95,-1.3; 2 0,-1.3; 3 0.95,-1.3; 4 0.95,1.3; 5 -0.95,1.3
HSOIC8 = smd 1.524 x 0.66: 1 -2.973,1.905; 2 -2.973,0.635; 3 -2.973,-0.635; 4 -2.973,-1.905; 5 2.973,-1.905; 6 2.973,-0.635; 7 2.973,0.635; 8 2.973,1.905 | smd 2.4 x 3.1: TGND 0,0

### Placement (x,y rotation side)
C1  13,37 0 top
C2  54,35 90 top
C3  7,42 180 top
C4  56,40 90 top
C5  48,50 270 top
C6  62,50 180 top
C7  62,23 180 top
C8  62,61 180 top
C9  66,39 270 top
C10  25,20 0 top
C17  52,35 90 top
C20  54,40 90 top
C21  50,40 90 top
C22  52,40 90 top
C26  50,50 270 top
C27  50,35 90 top
D1  46,14 180 top
D3  30,72 270 top
D4  14,14 180 top
D5  30,14 180 top
D7  55,78 180 top
F2  8,70 270 top
F5  13,80 90 top
IC2  55,83 180 top
IC7  43,31 270 top
J1  66,12 270 top
J2  48.5,21 270 top
J3  37,89 0 top
J4  1.5,80 270 top
J5  51,8 180 top
J7  19,8 180 top
J8  55,89 0 top
J9  43,85 180 top
J10  35,8 180 top
J11  19,25 90 top
J12  5.5,9.5 0 top
J13  38.5,21 270 top
J17  11,89 0 top
J23  42.5,60 270 top
L1  61,40 270 top
LED1  66,80 270 top
LED2  35,60 0 top
LED3  25,28 180 top
LED4  25,26 180 top
LED5  25,24 180 top
LED6  25,22 180 top
MOD1  35,39 0 top
MOD2  6.04,56 90 top
Q1  35,39 270 top
R1  60,11 90 top
R2  2.5,73 180 top
R3  2.5,87 180 top
R4  34,83 180 top
R5  29,28 0 top
R6  29,26 0 top
R7  29,24 0 top
R8  29,22 0 top
R9  48,74 0 top
R10  48,72 0 top
R11  48,70 0 top
R12  48,68 0 top
R13  66,84 90 top
R14  30,62 270 top
R15  32,39 270 top
R16  30,39 90 top
R20  13,39 180 top
R25  39,31 90 top
R35  59,30 0 top
R36  63,30 0 top
R37  56,31 90 top
R38  13,73 0 top
R39  21,43 180 top
R40  21,40 180 top
S1  7,39 0 top
S2  13,70 0 top
S3  39,72 0 top
SPKR2  38,47 270 top
SW1  22,92 270 top
U1  7,25 0 top
U$4  22,85 0 top
U$5  57,84 0 top
U$6  9,5 0 top
VR2  53,50 0 top
VR3  61,34 0 top

### Tracks (layer width: path | path; a pad name or v marks a point on that pad's centre or on a via)
3.3V  (via drill 0.35)
  Top 0.305: R12.2 R11.2 R10.2 R9.2 v50,74 | R8.2 R7.2 R6.2 R5.2 v31,28 | R13.2 v66,86 | SPKR2.1 35.63,53.87 LED2.2 | IC2.1 60.35,81 v58,81 | R20.1 15.42,39 MOD1.VCC 20.73,37.73 21.76,38.76 R40.1 R39.1 | R38.1 v11,73 | J1.2 60.24,12 R1.2 | J12.2 v5,11
  Top 0.406: MOD2.2 8.81,44.91 7.9,44 C3.1 v9,42
  Top 0.61: C26.1 C5.1 v48,52 | C26.1 v50,52 | C26.1 51.65,50.9 VR2.5 | C8.+ v55,61
  pour Route2: 0.13,0.13 69.87,0.13 69.87,93.87 0.13,93.87
5V  (via drill 0.35)
  Top 0.305: IC2.8 49.65,81 v52,81 | R36.2 v65,30 | C10.1 J11.5
  Top 0.406: U1.9 18.45,20.55 J11.5 | VR2.1 52.05,47.45 52.5,47 53.5,47 53.95,47.45 VR2.3 55.2,48.7 56.38,49.88 57.88,49.88
  Top 0.61: C6.+ 57.88,49.88 58,49.75 58,47 59.2,45.8 L1.2 59.2,39.2 59,39 58.9,39.1 58.8,39 v57.5,39 56.1,39 C4.1 C20.1 C22.1 C21.1 v50,38 | v8,70 F2.2
  Route15 0.305: v52,81 52,67.08 47.46,62.54
  Route15 0.61: J11.5 27,20 45,38 v50,38 51.5,39.5 51.5,58.5 47.46,62.54 J23.1 37.54,67.5 10.5,67.5 v8,70
  Bottom 0.305: v65,30 59,30 57.5,31.5 v57.5,39
12V  (via drill 0.35)
  Top 0.61: C27.1 C17.1 C2.1 | VR3.3 57.63,33.37 57,34 | 57,34 57.63,34.63 VR3.2 | C2.1 56.9,34.1 57,34 | C7.+ 57,23 54,26 v54,33 C2.1 | D3.C v30,72 | IC7.5 40.89,28 v40,28
  Route15 0.61: v40,28 49,28 v54,33
  Bottom 0.61: v30,72 38.5,72 54,56.5 v54,33
!RESET
  Top 0.305: MOD2.3 10.08,41.53 9.05,40.5 S1.2 R20.2 C1.1
CAN_H1
  Top 0.305: IC2.7 52.63,82.36 54.05,80.95 D7.2
  Top 0.406: J3.1 31.8,88.48 R4.2 31.8,81.2 33,80 38,80 40.37,82.36 IC2.7
  Bottom 0.406: J8.1 47.28,87 33.28,87 J3.1
CAN_L1
  Top 0.305: D7.1 55.95,81.05 53.37,83.64 53,83.64 | 53,83.64 IC2.6 | J8.2 53.1,83.73 53,83.64
  Top 0.406: J3.2 37.1,87 42.27,87 J9.1 45.63,83.64 IC2.6
GND  (via drill 0.35)
  Top 0.406: IC7.TGND 43.5,31 43.63,30.86 IC7.7 | IC7.TGND v40.5,31 | IC7.TGND v45.5,31 | IC7.1 44.91,35.91 | v56,42.5 C4.2 C20.2 C22.2 C21.2 v50,42.5 | C26.2 v50,48 | C5.2 v48,48 | VR2.2 53,52.5 | v56,36 54,36 C2.2 C17.2 | C17.2 v52,37.5 | C17.2 C27.2
  Top 0.61: C6.- v63,50 | C8.- v63,61 | C7.- v63,23 | MOD2.1 7.54,49.04 v8.5,50 | MOD2.40 7.54,62.96 v8.5,62 | 11.03,54.97 MOD2.41 14.96,55 v18.5,55 | v61,37 VR3.TGND v61,31 | VR3.1 56.09,35.91 v56,36
  other vias: 11,57.5 11,53 56.5,76 53.5,76 7,20.5
  pour Top: 0.13,0.13 69.87,0.13 69.87,93.87 0.13,93.87
  pour Bottom: 0.13,0.13 69.87,0.13 69.87,93.87 0.13,93.87
  pour Route15: 0.13,0.13 69.87,0.13 69.87,93.87 0.13,93.87
IO0_LED
  Top 0.305: R14.1 27.96,64.8 MOD2.27 24.05,67.95 23,69 16.05,69 S2.2 15.05,71.71 R38.2
IO4_SCL  (via drill 0.35)
  Top 0.305: R40.2 16.96,40 MOD1.SCL 14.73,40.27 11.35,43.65 MOD2.4 | v8.5,9 7,9 J12.4
  Bottom 0.305: J5.3 51,11 50.5,11.5 35.5,11.5 35,11 | 35,11 J10.3 | 35,11 34.5,11.5 19.5,11.5 19,11 | J7.3 19,11 | 19,11 18.5,11.5 14,11.5 | 14,11.5 11,11.5 v8.5,9 | MOD1.SCL 14.77,40.27 14,39.5 14,11.5
IO5_SDA
  Top 0.305: R39.2 16.88,43 MOD1.SDA 14.69,42.81 12.62,44.88 MOD2.5 | J7.4 19,5 | 19,5 19.5,4.5 34.5,4.5 35,5 | J10.4 35,5 | 35,5 35.5,4.5 50.5,4.5 51,5 J5.4 | 19,5 18.5,4.5 13.5,4.5 11,7 6.5,7 6,7.5 J12.3
  Bottom 0.305: J7.4 19,5 18.5,4.5 10,4.5 7,7.5 7,15 11,19 11,40 13.81,42.81 MOD1.SDA
IO6_Y_IN1  (via drill 0.35)
  Top 0.305: MOD2.6 13.89,49.11 v13,50 | v2.5,29.5 4.14,29.5 U1.1
  Route15 0.305: v13,50 2.5,39.5 v2.5,29.5
IO7_Y_IN2  (via drill 0.35)
  Top 0.305: MOD2.7 15.16,49.34 v14.5,50 | v6,28.5 5.67,28.18 U1.2
  Route15 0.305: v14.5,50 4.5,40 4.5,30 v6,28.5
IO8_Y_IN3  (via drill 0.35)
  Top 0.305: U1.3 4.11,27 v2.5,27 | v21.5,49.5 21.5,47.21 MOD2.12
  Route15 0.305: v2.5,27 7,27 7.5,27.5 7.5,39 18,49.5 v21.5,49.5
IO9_Y_IN4  (via drill 0.35)
  Top 0.305: U1.4 4.33,25.5 v6,25.5 | v27.5,51.5 25.51,51.5 MOD2.17
  Route15 0.305: v6,25.5 7,25.5 8.5,27 8.5,38.5 17.5,47.5 23.5,47.5 v27.5,51.5
IO10_X_IN1
  Top 0.305: MOD2.18 27.66,52.84 35,45.5 40,45.5 42.37,43.13 IC7.3
IO11_X_IN2
  Top 0.305: MOD2.19 27.89,54.11 35.5,46.5 40.5,46.5 43.63,43.37 IC7.2
IO12_Y_LIMIT  (via drill 0.35)
  Top 0.305: J1.3 60.78,9.46 R1.1 | MOD2.20 28.12,55.38 v35.5,48
  Bottom 0.305: v35.5,48 35.5,46 53,28.5 53,20 63.54,9.46 J1.3
IO13_XSHUT1  (via drill 0.35)
  Top 0.305: D4.1 v17,14 | v22.5,56.5 25.29,56.5 MOD2.21
  Bottom 0.305: v17,14 17,31 22.5,36.5 v22.5,56.5
IO14_XSHUT2  (via drill 0.35)
  Top 0.305: D5.1 v33,14 | v23.5,58 25.36,58 MOD2.22
  Bottom 0.305: v33,14 26.5,14 25,15.5 25,56.5 v23.5,58
IO15_XSHUT3  (via drill 0.35)
  Top 0.305: MOD2.8 16.5,47.27 v16.5,50 | v49,14 D1.1
  Route2 0.305: v16.5,50 34,32.5 34,18 38,14 v49,14
IO16_CANTX  (via drill 0.35)
  Top 0.305: MOD2.9 17.7,51.2 v20.5,54 | v63,82 62.63,82.36 IC2.2
  Route2 0.305: v20.5,54 43,54 63,74 v63,82
IO17_CANRX  (via drill 0.35)
  Top 0.305: MOD2.10 18.97,50.47 v19.5,51 | v64,85 62.63,83.64 IC2.3
  Route2 0.305: v19.5,51 21.5,53 43.5,53 64,73.5 v64,85
IO18_PIEZO
  Top 0.305: R16.1 28.26,38.24 27.5,39 27.5,41.5 24,45 21,45 20.24,45.76 MOD2.11
IO38_ID1  (via drill 0.35)
  Top 0.254: R9.1 v46,74 37,74 | MOD2.31 18.97,63.03 19.5,62.5 v20,62.5
  Top 0.305: 37,74 35.19,72.19 S3.1
  Route2 0.254: v20,62.5 27,62.5 38.5,74 v46,74
IO39_ID2  (via drill 0.35)
  Top 0.254: R10.1 v46,72 39,72 | MOD2.32 17.7,62.8 v18,62.5
  Top 0.305: 39,72 37.73,70.73 S3.2
  Route2 0.254: v46,72 38,72 27.5,61.5 19,61.5 v18,62.5
IO40_ID3  (via drill 0.35)
  Top 0.254: R11.1 v46,70 41,70 | MOD2.33 16.5,64.73 16.5,63 v16,62.5
  Top 0.305: 41,70 40.27,69.27 S3.3
  Route2 0.254: v46,70 37.5,70 28,60.5 18,60.5 v16,62.5
IO41_ID4  (via drill 0.35)
  Top 0.254: R12.1 v46,68 43.21,68 S3.4 | MOD2.34 15.16,63.16 14.5,62.5 v14,62.5
  Route2 0.254: v46,68 37,68 28.5,59.5 17,59.5 v14,62.5
N$1
  Top 0.406: R4.1 38.2,85 J9.2
N$2
  Top 0.305: R14.2 31.24,60 LED2.4
N$3
  Top 0.305: D1.2 44.42,10.77 J5.6
N$4
  Bottom 0.61: J17.2 12.91,85.89 SW1.1 SW1.6
N$5
  Top 0.305: R25.2 39,33 39.79,33.79 IC7.4
N$6
  Top 0.254: R2.1 3.26,77.76 3.75,78.25 J4.B5
N$7
  Top 0.254: R3.1 3.26,82.24 4.25,81.25 J4.A5
N$8
  Top 0.61: F5.2 9.1,87.09 J17.1
N$9
  Top 0.61: D3.A 28.66,75.49 SW1.5
  Bottom 0.61: SW1.5 SW1.2
N$11  (via drill 0.35)
  Top 0.254: J4.A4B9 6.64,82.5 | J4.A9B4 6.64,77.5
  Top 0.406: 6.64,82.5 v8,82.5 | 6.64,77.5 v8,77.5
  Top 0.61: F2.1 8.5,72 8.5,77 v8,77.5
  Bottom 0.61: v8,82.5 v8,77.5
N$12
  Top 0.305: LED3.A R5.1
N$13
  Top 0.305: LED3.C 22.24,30 J11.1
  Top 0.406: U1.16 18.45,29.45 J11.1
N$14
  Top 0.305: LED4.A R6.1
N$15
  Top 0.305: R7.1 LED5.A
N$16
  Top 0.305: LED6.A R8.1
N$17
  Top 0.305: LED4.C 22.74,27.5 J11.2
  Top 0.406: U1.15 18.32,28.18 J11.2
N$18
  Top 0.305: LED5.C 23.24,25 J11.3
  Top 0.406: U1.14 17.09,26.91 J11.3
N$19
  Top 0.305: LED6.C 23.74,22.5 J11.4
  Top 0.406: U1.13 15.87,25.64 J11.4
N$21
  Top 0.305: J23.2 LED2.1
N$22
  Top 0.305: D5.2 28.43,10.77 J10.6
N$23
  Top 0.305: R16.2 R15.1 33.81,39.76 Q1.1
N$24
  Top 0.305: Q1.3 38,40.9 SPKR2.2
N$25
  Top 0.406: J13.2 42.37,26.11 IC7.6
  Bottom 0.406: J2.1 45.25,19.75 42.75,22.25 J13.2
N$26
  Top 0.406: J13.1 42.75,19.75 45.25,22.25 | 45.25,22.25 J2.2 | IC7.8 44.91,22.59 45.25,22.25
N$27
  Top 0.305: D4.2 12.43,10.77 J7.6
N$29
  Top 0.305: R13.1 LED1.A
N$30
  Top 0.305: C9.1 63.04,39.76 L1.1
  Top 0.61: VR3.8 63.97,37.53 63,38.5 63,39.72 63.04,39.76
N$33
  Top 0.305: VR3.4 56.33,32.09 R37.2
N$35
  Top 0.305: R35.2 R36.1 62.24,30.86 63.47,32.09 VR3.5
N$37
  Top 0.305: C9.2 66,35 65.64,34.63 VR3.7
USB_DM  (via drill 0.35)
  Top 0.254: J4.A7 7.75,79.75 8,80 8,80.5 7.75,80.75 J4.B7 2.75,80.75 v2.5,80.5
  Top 0.305: MOD2.13 22.5,47.48 22.5,54 v19.5,57
  Route15 0.305: v19.5,57 16.5,60 13.5,60 3,70.5 3,78.5 2.5,79 v2.5,80.5
USB_DP  (via drill 0.35)
  Top 0.254: J4.A6 5.25,80.25 5,80 5,79.5 5.25,79.25 J4.B6
  Top 0.305: MOD2.14 24.05,48.95 23.5,49.5 23.5,54 20.5,57 v20.5,58 | v4,79.5 5,79.5
  Route15 0.305: v20.5,58 17.5,61 14,61 4,71 v4,79.5
VIN+
  Top 0.61: J3.3 38.91,91.09 38,92 30,92 27,89 20,89 17,86 17,81 13,77 F5.1
  Bottom 0.61: J8.3 56.91,91.09 56,92 40,92 38.91,90.91 J3.3

### Text on the board
tPlace: CAN / TERM | ID | 2A FUSE | Steve! | SNOOT | VIN: 12Vdc | Super / House | 5V | LED | GND | Conveyor Controller | by Jon Oxer | RESET | Y-Stepper | Front | Rear | GND | 3V3 | SDA | SCL | LIMIT | GND | 1 | 2 | 3 | 3V3 | SIG | I2C | v3.0
bPlace: GND | GND | VIN+ | VIN+ | CAN_H | CAN_L | CAN_H | CAN_L | www.superhouse.tv/conveyor | Copyright 2022-2025 SuperHouse Automation P/L / Released under the TAPR Open Hardware License / tapr.org/OHL | Made in / Australia | !INT | SCL | 3V3 | !INT | SCL | 3V3 | !INT | SCL | 3V3 | !XSHUT | SDA | GND | !XSHUT | SDA | GND | !XSHUT | SDA | GND